# EAGLE design LED_PCB_Smartphone_LED (EAGLE 8.7.1)
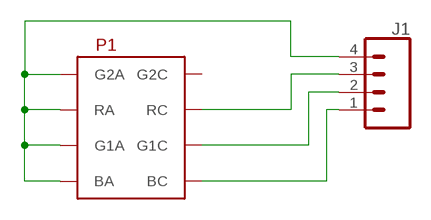
[diagram p0: schematic, sheet 1]

## Parts
J1  CONN_04LONGPADS  [1X04_LONGPADS]
P1  LZ4-00MC00  [LZ4]

## Nets
N$1: J1.4 P1.1(G2A) P1.3(RA) P1.5(G1A) P1.7(BA)
N$2: J1.1 P1.8(BC)
N$5: J1.3 P1.4(RC)
N$6: J1.2 P1.6(G1C)
Unconnected: P1.2(G2C)

## Library data of the parts
J1 = SparkFun-Connectors:CONN_04: Multi connection point. Often used as Generic Header-pin footprint for 0.1 inch spaced/style header connections On any of the 0.1 inch spaced packages, you can populate with these: Break Away Headers - Straight <https://www.sparkfun.com/products/116> (PRT-00116) Break Away Male Headers - Right Angle <https://www.sparkfun.com/products/553> (PRT-00553) Female Headers <https://www.sparkfun.com/products/115> (PRT-00115) Break Away Headers - Machine Pin <https://www.sparkfun.com/products/117> (PRT-00117) Break Away Female Headers - Swiss Machine Pin <https://www.sparkfun.com/products/743> (PRT-00743) For SCREWTERMINALS and SPRING TERMINALS visit here: Screw Terimnals on SparkFun.com <https://www.sparkfun.com/search/results?term=Screw+Terminals> (5mm/3.5mm/2.54mm spacing) This device is also useful as a general connection point to wire up your design to another part of your project. Our various solder wires solder well into these plated through hole pads. Hook-Up Wire - Assortment (Stranded, 22 AWG) <https://www.sparkfun.com/products/11375> (PRT-11375) Hook-Up Wire - Assortment (Solid Core, 22 AWG) <https://www.sparkfun.com/products/11367> (PRT-11367) View the entire wire category on our website here <https://www.sparkfun.com/categories/141> Special notes: Molex polarized connector foot print use with SKU : PRT-08231 with associated crimp pins and housings. 1MM SMD Version SKU: PRT-10208; PROD_ID: CONN-09696
P1 = OWN:LZ4-00MC00: LZ4-00MC00 - RGB Diode

## Net classes
0 default: width 0.508 mm, clearance 0.127 mm

## Board
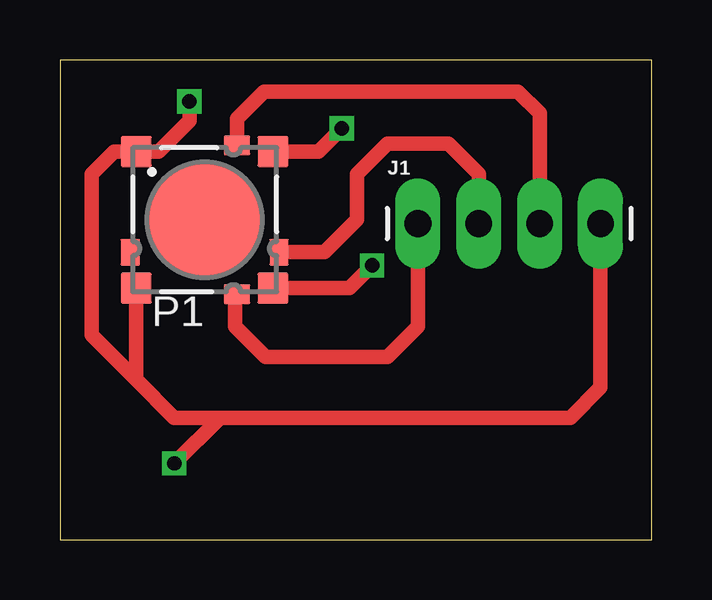
[diagram p1: board, top side]
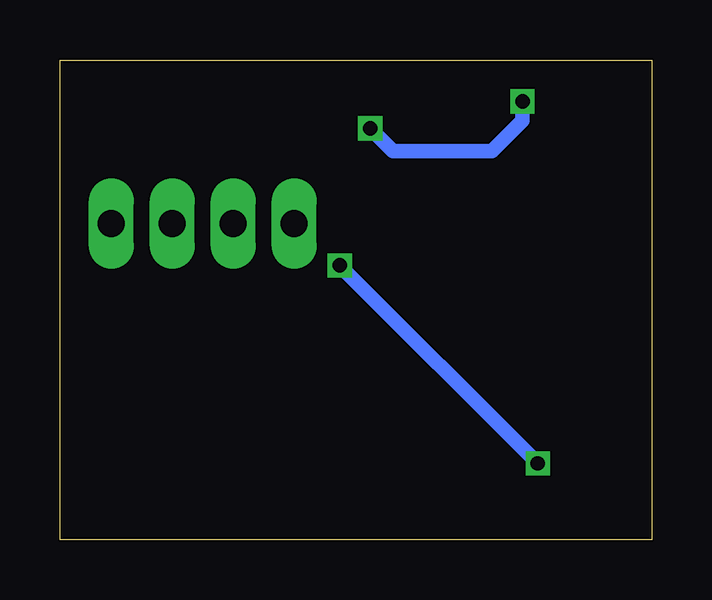
[diagram p2: board, bottom side, seen from below]

Size 24.68 x 20 mm. Coordinates in mm from the lower left corner, seen from the top.
Outline: 0,0 24.68,0 24.68,20 0,20 0,0
Copper layers (1*16): Top 0.035mm / dielectric 1.5mm / Bottom 0.035mm
Design rules "default": minimum track width 6mil, minimum drill 0.35mm, track to track 6mil, track to pad 6mil, pad to pad 6mil, via to via 6mil, smd to smd 6mil, copper to edge 40mil, drill to drill 6mil, minimum pad ring 10mil, minimum via ring 8mil, stop-mask expansion 4mil, vias tented up to drill 0mil, thermal gap 10mil

### Footprints (pad centres in the part's own frame; a part is rotated, then mirrored left to right if it is on the bottom)
1X04_LONGPADS = drill 1.118 pad 1.88 long: 1 0,0; 2 2.54,0; 3 5.08,0; 4 7.62,0
LZ4 = smd 1.3 x 1.3: 1 -2.85,2.85; 3 2.85,2.85; 5 2.85,-2.85; 7 -2.85,-2.85 | smd 1.1 x 0.8: 2 -1.35,3.1; 6 -1.35,-3.1 | smd 0.8 x 1.1: 4 3.1,-1.35; 8 -3.1,-1.35 | smd 5 x 5: 9 0,0

### Placement (x,y rotation side)
J1  14.92,13.18 0 top
P1  6.03,13.34 90 top

### Tracks (layer width: path | path; a pad name or v marks a point on that pad's centre or on a via)
N$1  (via drill 0.6)
  Top 0.61: J1.4 22.54,6.35 21.27,5.08 6.67,5.08 | 6.67,5.08 4.76,5.08 3.18,6.67 | 3.18,6.67 3.18,10.48 P1.1 | 3.18,6.67 1.32,8.52 1.32,15.24 2.27,16.18 P1.3 4.12,16.18 5.4,17.46 v5.4,18.27 | P1.7 12.07,10.48 v13.02,11.43 | v4.76,3.17 6.67,5.08 | P1.5 10.79,16.18 v11.75,17.14
  Bottom 0.61: v13.02,11.43 v4.76,3.17 | v11.75,17.14 11.11,16.51 10.8,16.19 6.67,16.19 5.4,17.46 v5.4,18.27
N$2
  Top 0.61: J1.1 14.92,8.89 13.65,7.62 8.57,7.62 7.3,8.89 7.3,10.15 P1.8
N$5
  Top 0.61: J1.3 20,16.51 | 20,16.51 | 20,16.51 20,17.78 19.1,18.68 8.52,18.68 7.38,17.54 P1.4
N$6
  Top 0.61: J1.2 17.46,15.24 16.19,16.51 13.65,16.51 12.38,15.24 12.38,13.34 11.03,11.98 P1.6